# EAGLE design motor_driver_v1.0 (EAGLE 8.2.0)
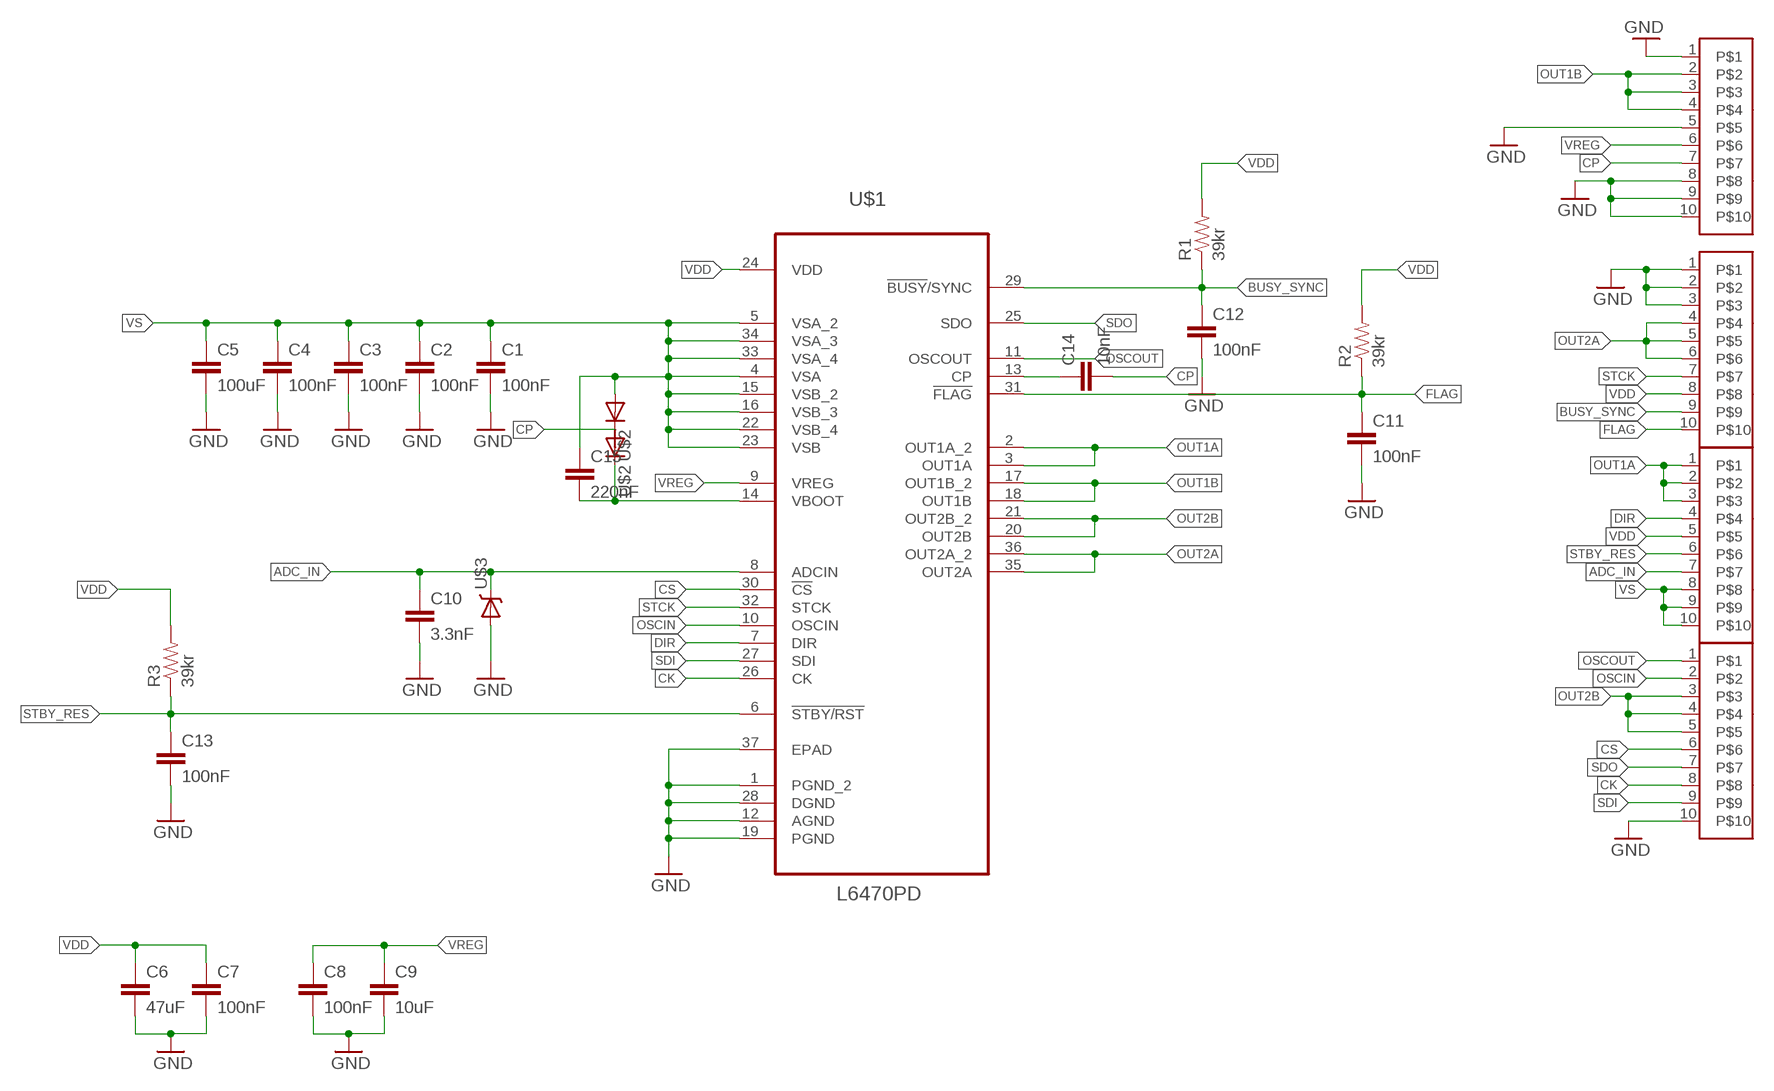
[diagram p0: schematic, sheet 1]

## Parts
C1  100nF  CAP0603  [0603-CAP]
C2  100nF  CAP0603  [0603-CAP]
C3  100nF  CAP0603  [0603-CAP]
C4  100nF  CAP0603  [0603-CAP]
C5  100uF  CAP  [CAP-10X12]
C6  47uF  CAP1206  [1206-CAP]
C7  100nF  CAP0603  [0603-CAP]
C8  100nF  CAP0603  [0603-CAP]
C9  10uF  CAP0805  [0805-CAP]
C10  3.3nF  CAP0603  [0603-CAP]
C11  100nF  CAP0603  [0603-CAP]
C12  100nF  CAP0603  [0603-CAP]
C13  100nF  CAP0603  [0603-CAP]
C14  10nF  CAP0603  [0603-CAP]
C15  220nF  CAP0603  [0603-CAP]
R1  39kr  RESISTOR0603-RES  [0603-RES]
R2  39kr  RESISTOR0603-RES  [0603-RES]
R3  39kr  RESISTOR0603-RES  [0603-RES]
U$1  L6470PD  [SOP65P1400X360-37N]
U$2  BAV99  [BAV99]
U$3  BZX585  [BZX585]
U$4  CON_TH_10PINS  [CON_TH_10POS]
U$5  CON_TH_10PINS  [CON_TH_10POS]
U$6  CON_TH_10PINS  [CON_TH_10POS]
U$7  CON_TH_10PINS  [CON_TH_10POS]

## Nets
ADC_IN: C10.P$1 U$1.8(ADCIN) U$3.P$1 U$4.7
BUSY_SYNC: C12.P$1 R1.1 U$1.29(!BUSY!/SYNC) U$5.9
CK: U$1.26(CK) U$7.8
CP: C14.P$2 U$2.P$3 U$6.7
CS: U$1.30(!CS) U$7.6
DIR: U$1.7(DIR) U$4.4
FLAG: C11.P$1 R2.1 U$1.31(!FLAG) U$5.10
GND: C1.P$2 C2.P$2 C3.P$2 C4.P$2 C5.P$2 C6.P$2 C7.P$2 C8.P$2 C9.P$2 C10.P$2 C11.P$2 C12.P$2 C13.P$2 U$1.1(PGND_2) U$1.12(AGND) U$1.19(PGND) U$1.28(DGND) U$1.37(EPAD) U$3.P$2 U$5.1 U$5.2 U$5.3 U$6.1 U$6.5 U$6.8 U$6.9 U$6.10 U$7.10
N$1: C15.P$2 U$1.14(VBOOT) U$2.P$2
N$2: C14.P$1 U$1.13(CP)
OSCIN: U$1.10(OSCIN) U$7.2
OSCOUT: U$1.11(OSCOUT) U$7.1
OUT1A: U$1.2(OUT1A_2) U$1.3(OUT1A) U$4.1 U$4.2 U$4.3
OUT1B: U$1.17(OUT1B_2) U$1.18(OUT1B) U$6.2 U$6.3 U$6.4
OUT2A: U$1.35(OUT2A) U$1.36(OUT2A_2) U$5.4 U$5.5 U$5.6
OUT2B: U$1.20(OUT2B) U$1.21(OUT2B_2) U$7.3 U$7.4 U$7.5
SDI: U$1.27(SDI) U$7.9
SDO: U$1.25(SDO) U$7.7
STBY_RES: C13.P$1 R3.1 U$1.6(!STBY/RST) U$4.6
STCK: U$1.32(STCK) U$5.7
VDD: C6.P$1 C7.P$1 R1.2 R2.2 R3.2 U$1.24(VDD) U$4.5 U$5.8
VREG: C8.P$1 C9.P$1 U$1.9(VREG) U$6.6
VS: C1.P$1 C2.P$1 C3.P$1 C4.P$1 C5.P$1 C15.P$1 U$1.4(VSA) U$1.5(VSA_2) U$1.15(VSB_2) U$1.16(VSB_3) U$1.22(VSB_4) U$1.23(VSB) U$1.33(VSA_4) U$1.34(VSA_3) U$2.P$1 U$4.8 U$4.9 U$4.10

## Library data of the parts
C1-C15 = Usefull_ICs:CAP: Capacitor Standard 0603 ceramic capacitor, and 0.1" leaded capacitor.
R1-R3 = Usefull_ICs:RESISTOR: Resistor Basic schematic elements and footprints for 0603, 1206, and PTH 1/10th watt (small) resistors.
U$1 = Usefull_ICs:L6470PD
U$2 = Usefull_ICs:BAV99
U$3 = Usefull_ICs:BZX585
U$4-U$7 = Usefull_ICs:CON_TH_10PINS

## Board
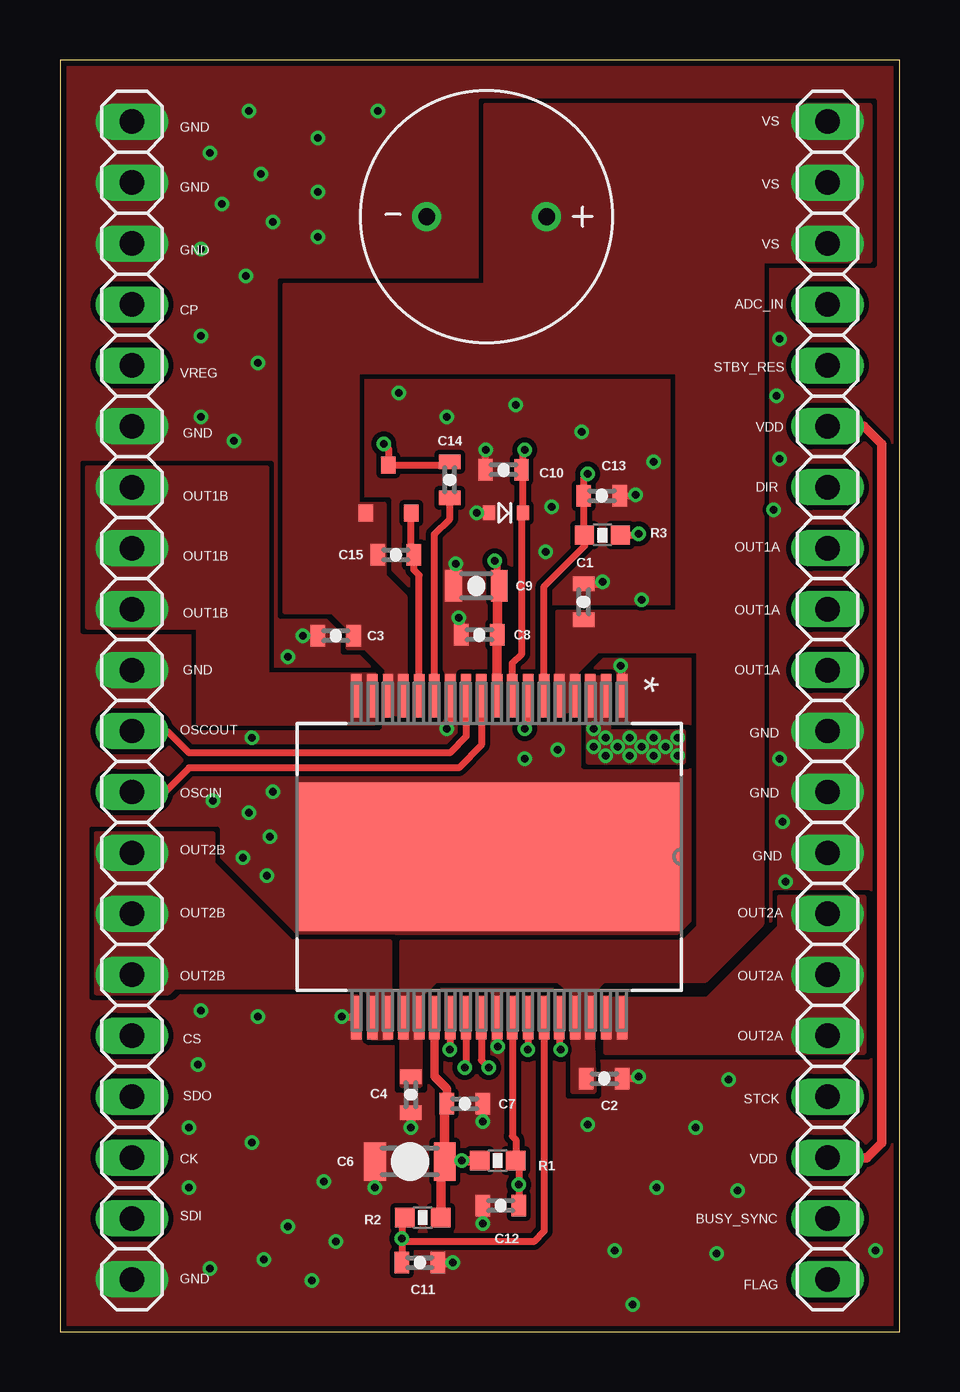
[diagram p1: board, top side]
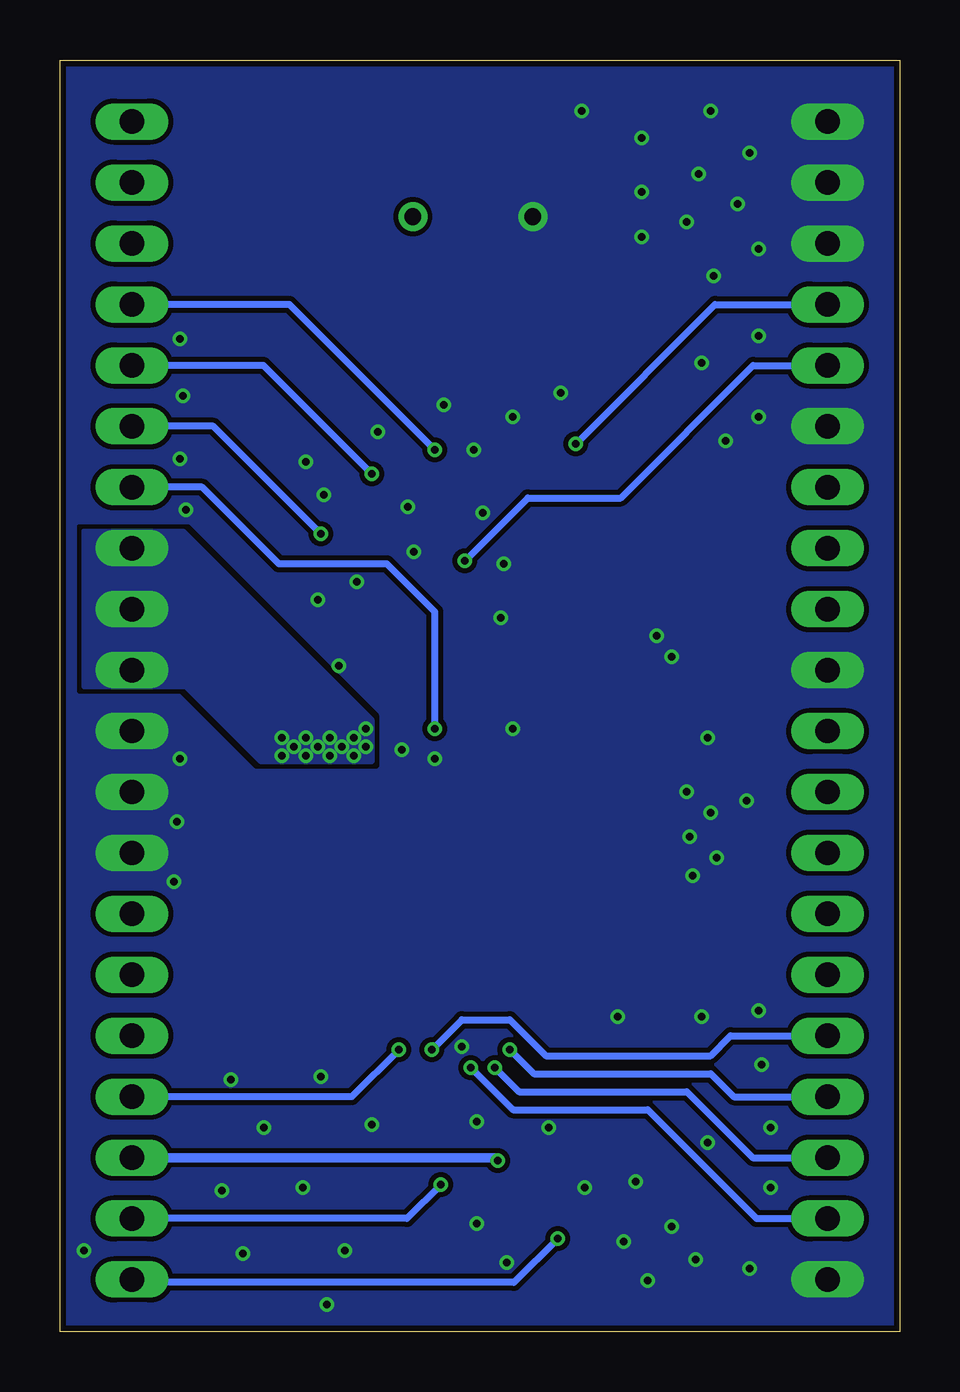
[diagram p2: board, bottom side, seen from below]

Size 35 x 53 mm. Coordinates in mm from the lower left corner, seen from the top.
Outline: 0,0 35,0 35,53 0,53 0,0
Copper layers (1*16): Top 0.035mm / dielectric 1.5mm / Bottom 0.035mm
Design rules "SeeedStudio_2layer_DRU_no_angle_20140221": minimum track width 6mil, minimum drill 12mil, track to track 6mil, track to pad 6mil, pad to pad 6mil, via to via 6mil, smd to smd 0mil, copper to edge 10mil, drill to drill 10mil, minimum pad ring 10mil, minimum via ring 6mil, stop-mask expansion 2mil, vias tented up to drill 100mil, thermal gap 10mil

### Footprints (pad centres in the part's own frame; a part is rotated, then mirrored left to right if it is on the bottom)
0603-CAP = smd 0.6 x 0.9: P$1 -0.75,0; P$2 0.75,0
CAP-10X12 = drill 0.7: P$1 -2.5,0; P$2 2.5,0
1206-CAP = smd 0.9 x 1.6: P$1 -1.45,0; P$2 1.45,0
0805-CAP = smd 0.7 x 1.3: P$1 -0.95,0; P$2 0.95,0
0603-RES = smd 0.8 x 0.8: 1 -0.75,0; 2 0.75,0
SOP65P1400X360-37N = smd 1.803 x 0.432: 1 -6.706,5.537; 2 -6.706,4.877; 3 -6.706,4.216; 4 -6.706,3.581; 5 -6.706,2.921; 6 -6.706,2.286; 7 -6.706,1.626; 8 -6.706,0.965; 9 -6.706,0.33; 10 -6.706,-0.33; 11 -6.706,-0.965; 12 -6.706,-1.626; 13 -6.706,-2.286; 14 -6.706,-2.921; 15 -6.706,-3.581; 16 -6.706,-4.216; 17 -6.706,-4.877; 18 -6.706,-5.537; 19 6.706,-5.537; 20 6.706,-4.877; 21 6.706,-4.216; 22 6.706,-3.581; 23 6.706,-2.921; 24 6.706,-2.286; 25 6.706,-1.626; 26 6.706,-0.965; 27 6.706,-0.33; 28 6.706,0.33; 29 6.706,0.965; 30 6.706,1.626; 31 6.706,2.286; 32 6.706,2.921; 33 6.706,3.581; 34 6.706,4.216; 35 6.706,4.877; 36 6.706,5.537 | smd 6.198 x 16.002: 37 0,0
BAV99 = smd 0.6 x 0.7: P$1 0.95,1; P$2 -0.95,1; P$3 0,-1
BZX585 = smd 0.5 x 0.6: P$1 -0.7,0; P$2 0.7,0
CON_TH_10POS = drill 1.016 long: 1 -11.43,0; 2 -8.89,0; 3 -6.35,0; 4 -3.81,0; 5 -1.27,0; 6 1.27,0; 7 3.81,0; 8 6.35,0; 9 8.89,0; 10 11.43,0

### Placement (x,y rotation side)
C1  21.83,30.41 90 top
C2  22.69,10.54 0 top
C3  11.5,29 180 top
C4  14.62,9.88 270 top
C5  17.79,46.47 180 top
C6  14.59,7.09 180 top
C7  16.88,9.5 0 top
C8  17.48,29.04 180 top
C9  17.36,31.08 180 top
C10  18.49,35.91 180 top
C11  15,2.88 0 top
C12  18.38,5.25 180 top
C13  22.59,34.84 0 top
C14  16.25,35.5 90 top
C15  14,32.38 0 top
R1  18.25,7.12 180 top
R2  15.12,4.75 0 top
R3  22.61,33.2 0 top
U$1  17.89,19.79 270 top
U$2  13.7,35.12 180 top
U$3  18.59,34.12 180 top
U$4  32,39 90 top
U$5  32,13.6 270 top
U$6  3,39 90 top
U$7  3,13.6 270 top

### Tracks (layer width: path | path; a pad name or v marks a point on that pad's centre or on a via)
ADC_IN  (via drill 0.3)
  Top 0.3: U$1.8 18.86,27.86 19.25,28.25 19.25,34.08 U$3.P$1 19.3,35.86 | 19.3,35.86 C10.P$1 | 19.3,35.86 19.3,36.67 v19.38,36.75
  Bottom 0.3: v19.38,36.75 25.43,42.81 U$4.7
BUSY_SYNC  (via drill 0.3)
  Top 0.3: U$1.29 18.86,8.14 19,8 R1.1 19.12,7 v19.12,6.12 C12.P$1
  Bottom 0.3: v19.12,6.12 20.54,4.71 U$5.9
CK  (via drill 0.3)
  Top 0.3: U$1.26 16.93,11.05 v16.88,11
  Bottom 0.3: v16.88,11 15.88,10 8.88,10 6.12,7.25 U$7.8
CP  (via drill 0.3)
  Top 0.3: v13.5,37 13.7,36.8 U$2.P$3 16.11,36.12 C14.P$2
  Bottom 0.3: v13.5,37 7.69,42.81 U$6.7
CS  (via drill 0.3)
  Top 0.3: U$1.30 19.52,11.77 v19.5,11.75
  Bottom 0.3: v19.5,11.75 18.25,13 16.25,13 14.75,11.5 7.88,11.5 7.04,12.33 U$7.6
DIR  (via drill 0.3)
  Top 0.3: U$1.7 19.52,25.27 v19.38,25.12
  Bottom 0.3: v19.38,25.12 19.38,30 21.38,32 25.88,32 29.07,35.19 U$4.4
FLAG  (via drill 0.3)
  Top 0.3: U$1.31 20.18,4.18 19.75,3.75 14.38,3.75 v14.25,3.88 | R2.1 14.25,4.62 v14.25,3.88 | v14.25,3.88 C11.P$1
  Bottom 0.3: v14.25,3.88 16.08,2.04 31.92,2.04 32,2.12 U$5.10
GND  (via drill 0.3)
  Top 0.3: U$1.12 16.27,25.27 v16.12,25.12 | U$3.P$2 v17.38,34.12 | C13.P$2 23.96,34.84 v24,34.88 | C1.P$2 22.54,31.16 v22.62,31.25 | C8.P$2 16.73,29.64 v16.62,29.75 | C9.P$2 16.41,31.91 v16.5,32 | U$1.19 11.79,13.08 v11.75,13.12 | C6.P$2 13.13,6.01 v13.12,6 | C2.P$2 24.05,10.54 v24.12,10.62 | U$1.28 18.23,11.9 v18.25,11.88 | U$1.1 23.43,27.69 v23.38,27.75 | C3.P$2 v10.12,29 | C10.P$2 v17.74,36.74 v17.75,36.75
  Top 0.4: C7.P$2 v17.62,8.75 | C4.P$2 v14.62,8.5 | v17.62,4.5 C12.P$2 | C11.P$2 v16.38,2.88
  other vias: 6.25,49.12 10.75,49.75 8.88,46.25 8.25,40.38 5.88,41.5 5.88,38.12 16.12,38.12 21.75,37.5 30,41.38 29.88,39 24.75,36.25 20.25,32.5 24.25,30.5 9.5,28.12 19.38,23.88 7.88,21.62 7.62,19.75 8.25,13.12 5.75,11.12 5.38,8.5 5.38,6 6.25,2.62 11,6.25 10.5,2.12 9.5,4.38 23.12,3.38 27.38,3.25 28.25,5.88 24.88,6 22,8.62 26.5,8.5 27.88,10.5 34,3.38 23.88,1.12 5.88,13.38 30,23.88 30.12,21.25 30.25,18.75 20.75,24.25 29.75,34.25 30,36.38 20.5,34.38 19,38.62 14.12,39.12 13.25,50.88 5.88,45.12 6.38,22.12 8.88,22.5 8.75,20.62 8.62,19 8,24.75 7.25,37.12 8.38,48.25 6.75,47 7.75,44 7.88,50.88 10.75,47.5 10.75,45.62 8,7.88 8.5,3 11.5,3.75
  pour Top (isolate 0.2, rank 2, no thermals): -1,-1.12 -1,55 36,55 36,-1.12
  pour Bottom (isolate 0.2, rank 2, no thermals): 36,55 36,-1.12 -1,-1.12 -1,55
N$1
  Top 0.3: 14.62,34.09 U$2.P$2 14.64,32.48 | 14.64,32.48 C15.P$2 | U$1.14 14.97,31.53 14.75,31.75 C15.P$2 | C15.P$2 14.64,32.48
N$2
  Top 0.3: U$1.13 15.61,33.23 16.25,33.88 C14.P$1
OSCIN
  Top 0.3: U$1.10 17.57,24.44 16.62,23.5 5.38,23.5 4.38,22.5 U$7.2
OSCOUT
  Top 0.3: U$1.11 16.93,24.8 16.25,24.12 5.38,24.12 4.5,25 3.03,25 U$7.1
OUT1A  (via drill 0.3)
  other vias: 24.75,24.75 24.75,24 24.25,24.38 23.75,24.75 23.75,24 23.25,24.38 22.75,24.75 22.75,24 22.25,24.38 22.25,25.12 25.25,24.38 25.75,24.75 25.75,24
  pour Top (no thermals): 22,27.25 22,23.75 26,23.75 26,25 22.88,25 22.88,27.25
  pour Bottom (no thermals): 22,23.75 26.62,23.75 29.75,26.88 34,26.88 34,33.38 29.88,33.38 22,25.5
OUT1B
  pour Top (no thermals): 13.12,27.38 8.62,27.38 8.62,36 1.12,36 1.12,29.38 5.75,29.38 5.75,25.38 13.12,25.38
OUT2A
  pour Top (no thermals): 22.75,13.88 27,13.88 30,16.88 30,18.12 33.5,18.12 33.5,11.62 22.75,11.62
OUT2B
  pour Top (no thermals): 13.75,12.25 13.75,16.25 9.62,16.25 6.38,19.5 6.38,20.75 1.5,20.75 1.5,14.12 4.5,14.12 4.75,14.38 12.62,14.38 13,14 13,12.25
SDI  (via drill 0.3)
  Top 0.3: U$1.27 17.57,11.31 v17.88,11
  Bottom 0.3: v17.88,11 16.12,9.25 10.5,9.25 5.96,4.71 U$7.9
SDO  (via drill 0.3)
  Top 0.3: U$1.25 16.27,11.77 v16.25,11.75
  Bottom 0.3: v16.25,11.75 15.25,10.75 7.88,10.75 6.92,9.79 U$7.7
STBY_RES  (via drill 0.3)
  Top 0.3: U$1.6 20.18,31.06 21.86,32.74 R3.1 21.84,33.22 C13.P$1 21.84,35.59 v22,35.75
  Bottom 0.3: v22,35.75 26.52,40.27 U$4.6
STCK  (via drill 0.3)
  Top 0.3: U$1.32 20.82,11.81 v20.88,11.75
  Bottom 0.3: v20.88,11.75 22.84,9.79 U$5.7
VDD  (via drill 0.3)
  Top 0.3: R3.2 24.07,33.2 v24.12,33.25
  Top 0.35: U$1.24 15.61,10.64 16.12,10.12 C7.P$1
  Top 0.4: C7.P$1 16.04,9.41 C6.P$1 | U$4.5 32.02,37.75 33.5,37.75 34.25,37 34.25,7.88 33.62,7.25 U$5.8 | R2.2 15.88,6.93 C6.P$1 | R1.2 v16.75,7.12 16.07,7.12 C6.P$1
  Bottom 0.3: v24.12,33.25 28.61,37.73 U$4.5
  Bottom 0.4: v16.75,7.12 16.88,7.25 U$5.8
VREG  (via drill 0.3)
  Top 0.3: 18.23,31 18.23,32.02 v18.12,32.12
  Top 0.4: U$1.9 C8.P$1 18.23,31 C9.P$1
  Bottom 0.3: v18.12,32.12 15.5,34.75 11.62,34.75 6.11,40.27 U$6.6
VS
  pour Top (no thermals): 13.62,25.75 13.62,27.62 12.75,28.5 12,28.5 12,29.38 11.38,30 9.38,30 9.38,43.62 17.75,43.62 17.75,51.12 33.75,51.12 33.75,44.62 29.25,44.62 29.25,17 26.88,14.62 22.62,14.62 22.12,14.12 22.25,10 21.38,10 21.38,14.12 20.75,14.62 15.62,14.62 15,14 15,10.25 14.25,10.25 14.25,16.25 26,16.25 26.62,16.88 26.62,28.38 22.38,28.38 21.5,27.5 21.5,25.88 20.75,25.88 20.75,30 25.75,30 25.75,40 12.38,40 12.38,34.5 13.5,34.5 13.5,31.5 14.38,30.62 14.38,25.75

### Text on the board
tNames: GND | VS | GND | VS | GND | VS | ADC_IN | CP | VREG | STBY_RES | VDD | GND | OUT1B | DIR | OUT1B | OUT1A | OUT1B | OUT1A | GND | OUT1A | OSCOUT | GND | OSCIN | GND | OUT2B | GND | OUT2B | OUT2A | OUT2B | OUT2A | CS | OUT2A | SDO | STCK | CK | VDD | SDI | BUSY_SYNC | GND | FLAG